# EAGLE design board (EAGLE 5.12)
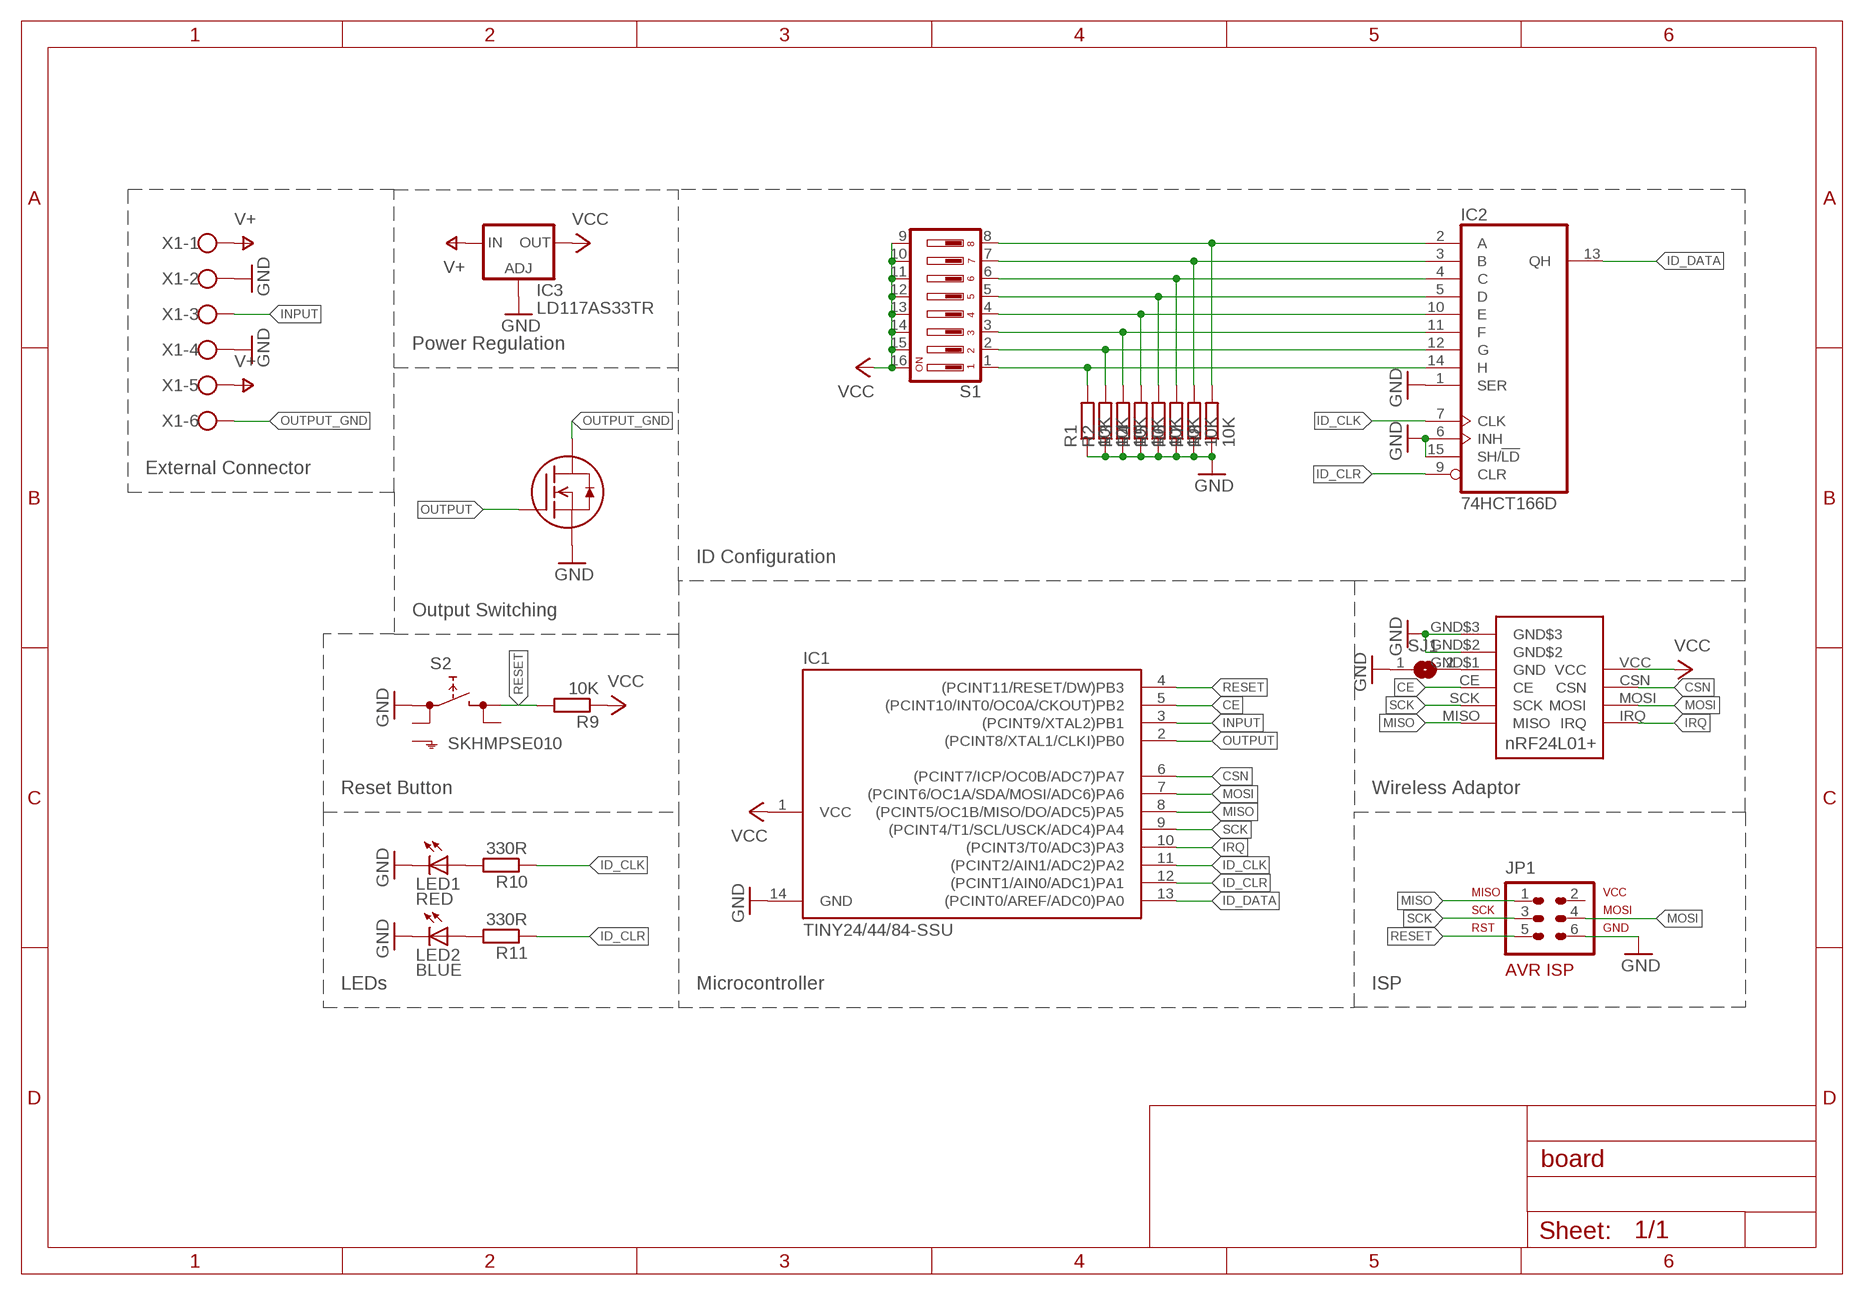
[diagram p0: schematic, sheet 1]

## Parts
CHINESE1  NRF24L01+CHINESE-DUAL  [CHINESE-DUALPINOUT]
IC1  TINY24/44/84-SSU  [SOIC14]
IC2  74HCT166D  [SO16]
IC3  LD117AS33TR  [SOT223]
JP1  AVR-ISP-6VERT  [AVR-ISP-6]
LED1  RED  LEDCHIPLED_1206  [CHIPLED_1206]
LED2  BLUE  LEDCHIPLED_1206  [CHIPLED_1206]
R1  10K  R-EU_R0805  [R0805]
R2  10K  R-EU_R0805  [R0805]
R3  10K  R-EU_R0805  [R0805]
R4  10K  R-EU_R0805  [R0805]
R5  10K  R-EU_R0805  [R0805]
R6  10K  R-EU_R0805  [R0805]
R7  10K  R-EU_R0805  [R0805]
R8  10K  R-EU_R0805  [R0805]
R9  10K  R-EU_R0805  [R0805]
R10  330R  R-EU_R0805  [R0805]
R11  330R  R-EU_R0805  [R0805]
S1  DS08  [DS-08]
S2  SKHMPSE010  [SKHMPXE010]
SJ1  SJ  [SJ]
U$1  NTF3055L108T1GTAB  [SOT223]
X1  W237-6  [W237-6]

## Nets
CE: CHINESE1.CE IC1.5((PCINT10/INT0/OC0A/CKOUT)PB2)
CSN: CHINESE1.CSN IC1.6((PCINT7/ICP/OC0B/ADC7)PA7)
GND: CHINESE1.GND$2 CHINESE1.GND$3 IC1.14(GND) IC2.1(SER) IC2.6(INH) IC2.15(SH/!LD) IC3.1(ADJ) JP1.6 LED1.C LED2.C R1.1 R2.1 R3.1 R4.1 R5.1 R6.1 R7.1 R8.1 S2.1(1.1) SJ1.1 U$1.3(S) X1.2 X1.4
ID_CLK: IC1.11((PCINT2/AIN1/ADC2)PA2) IC2.7(CLK) R10.1
ID_CLR: IC1.12((PCINT1/AIN0/ADC1)PA1) IC2.9(CLR) R11.1
ID_DATA: IC1.13((PCINT0/AREF/ADC0)PA0) IC2.13(QH)
INPUT: IC1.3((PCINT9/XTAL2)PB1) X1.3
IRQ: CHINESE1.IRQ IC1.10((PCINT3/T0/ADC3)PA3)
MISO: CHINESE1.MISO IC1.8((PCINT5/OC1B/MISO/DO/ADC5)PA5) JP1.1
MOSI: CHINESE1.MOSI IC1.7((PCINT6/OC1A/SDA/MOSI/ADC6)PA6) JP1.4
N$1: IC2.14(H) R1.2 S1.1
N$2: IC2.12(G) R2.2 S1.2
N$3: IC2.11(F) R3.2 S1.3
N$4: IC2.10(E) R4.2 S1.4
N$5: IC2.5(D) R5.2 S1.5
N$6: IC2.4(C) R6.2 S1.6
N$7: IC2.3(B) R7.2 S1.7
N$8: IC2.2(A) R8.2 S1.8
N$9: LED1.A R10.2
N$10: LED2.A R11.2
N$11: CHINESE1.GND$1(GND) SJ1.2
OUTPUT: IC1.2((PCINT8/XTAL1/CLKI)PB0) U$1.1(G)
OUTPUT_GND: U$1.4(D) X1.6
RESET: IC1.4((PCINT11/RESET/DW)PB3) JP1.5 R9.2 S2.3(2.1)
SCK: CHINESE1.SCK IC1.9((PCINT4/T1/SCL/USCK/ADC4)PA4) JP1.3
V+: IC3.3(IN) X1.1 X1.5
VCC: CHINESE1.VCC IC1.1(VCC) IC3.4(OUT) R9.1 S1.9 S1.10 S1.11 S1.12 S1.13 S1.14 S1.15 S1.16
Unconnected: JP1.2 S2.2(1.2) S2.4(2.2) S2.5(SH)

## Notes on the sheet
- Power Regulation
- External Connector
- ID Configuration
- Output Switching
- Reset Button | Wireless Adaptor
- LEDs | Microcontroller | ISP

## Power pins joined to a net without a drawn wire
GND: IC2.8(GND)
VCC: IC2.16(VCC)

## Library data of the parts
CHINESE1 = nrf24l01+:NRF24L01+
IC1 = avr-6:TINY24/44/84
IC2 = 74xx-eu:74*166: 8-bit parallel load SHIFT REGISTER
IC3 = v-reg:LD117A?*: Low drop fixed and adjustable positive voltage regulators 1 A Source: http://www.st.com/stonline/products/literature/ds/7194/ld1117axx.pdf
JP1 = avr-7:AVR-ISP-6: AVR ISP-6 Serial Programming Header
LED1 LED2 = led:LED: LED OSRAM: - CHIPLED LG R971, LG N971, LY N971, LG Q971, LY Q971, LO R971, LY R971 LH N974, LH R974 LS Q976, LO Q976, LY Q976 LO Q996 - Hyper CHIPLED LW Q18S LB Q993, LB Q99A, LB R99A - SideLED LS A670, LO A670, LY A670, LG A670, LP A670 LB A673, LV A673, LT A673, LW A673 LH A674 LY A675 LS A676, LA A676, LO A676, LY A676, LW A676 LS A679, LY A679, LG A679 - Hyper Micro SIDELED® LS Y876, LA Y876, LO Y876, LY Y876 LT Y87S - SmartLED LW L88C, LW L88S LB L89C, LB L89S, LG L890 LS L89K, LO L89K, LY L89K LS L896, LA L896, LO L896, LY L896 - TOPLED LS T670, LO T670, LY T670, LG T670, LP T670 LSG T670, LSP T670, LSY T670, LOP T670, LYG T670 LG T671, LOG T671, LSG T671 LB T673, LV T673, LT T673, LW T673 LH T674 LS T676, LA T676, LO T676, LY T676, LB T676, LH T676, LSB T676, LW T676 LB T67C, LV T67C, LT T67C, LS T67K, LO T67K, LY T67K, LW E67C LS E67B, LA E67B, LO E67B, LY E67B, LB E67C, LV E67C, LT E67C LW T67C LS T679, LY T679, LG T679 LS T770, LO T770, LY T770, LG T770, LP T770 LB T773, LV T773, LT T773, LW T773 LH T774 LS E675, LA E675, LY E675, LS T675 LS T776, LA T776, LO T776, LY T776, LB T776 LHGB T686 LT T68C, LB T68C - Hyper Mini TOPLED® LB M676 - Mini TOPLED Santana® LG M470 LS M47K, LO M47K, LY M47K Source: http://www.osram.convergy.de LUXEON: - LUMILED® LXK2-PW12-R00, LXK2-PW12-S00, LXK2-PW14-U00, LXK2-PW14-V00 LXK2-PM12-R00, LXK2-PM12-S00, LXK2-PM14-U00 LXK2-PE12-Q00, LXK2-PE12-R00, LXK2-PE12-S00, LXK2-PE14-T00, LXK2-PE14-U00 LXK2-PB12-K00, LXK2-PB12-L00, LXK2-PB12-M00, LXK2-PB14-N00, LXK2-PB14-P00, LXK2-PB14-Q00 LXK2-PR12-L00, LXK2-PR12-M00, LXK2-PR14-Q00, LXK2-PR14-R00 LXK2-PD12-Q00, LXK2-PD12-R00, LXK2-PD12-S00 LXK2-PH12-R00, LXK2-PH12-S00 LXK2-PL12-P00, LXK2-PL12-Q00, LXK2-PL12-R00 Source: www.luxeon.com KINGBRIGHT: KA-3528ASYC Source: www.kingbright.com
R1-R11 = rcl:R-EU_: RESISTOR, European symbol
S1 = switch-dil:DS08: DIL/CODE SWITCH; MPN: DS08; OC_FARNELL: unknown; OC_NEWARK: 73J0071
S2 = switch:SKHMP*E010: 6.2 X 6.5mm TACT Switch (SMD) Source: http://www3.alps.co.jp/WebObjects/catalog.woa/PDF/E/Switch/Tact/SKHM/SKHM.PDF
SJ1 = jumper:SJ: SMD solder JUMPER
U$1 = NTF3055L108:NTF3055L108T1G: Power MOSFET 3.0 A, 60 V, Logic Level, N?Channel SOT?223 Designed for low voltage, high speed switching applications in power supplies, converters and power motor controls and bridge circuits
X1 = con-wago-500:W237-6: WAGO SCREW CLAMP; OC_FARNELL: unknown; OC_NEWARK: unknown

## Board
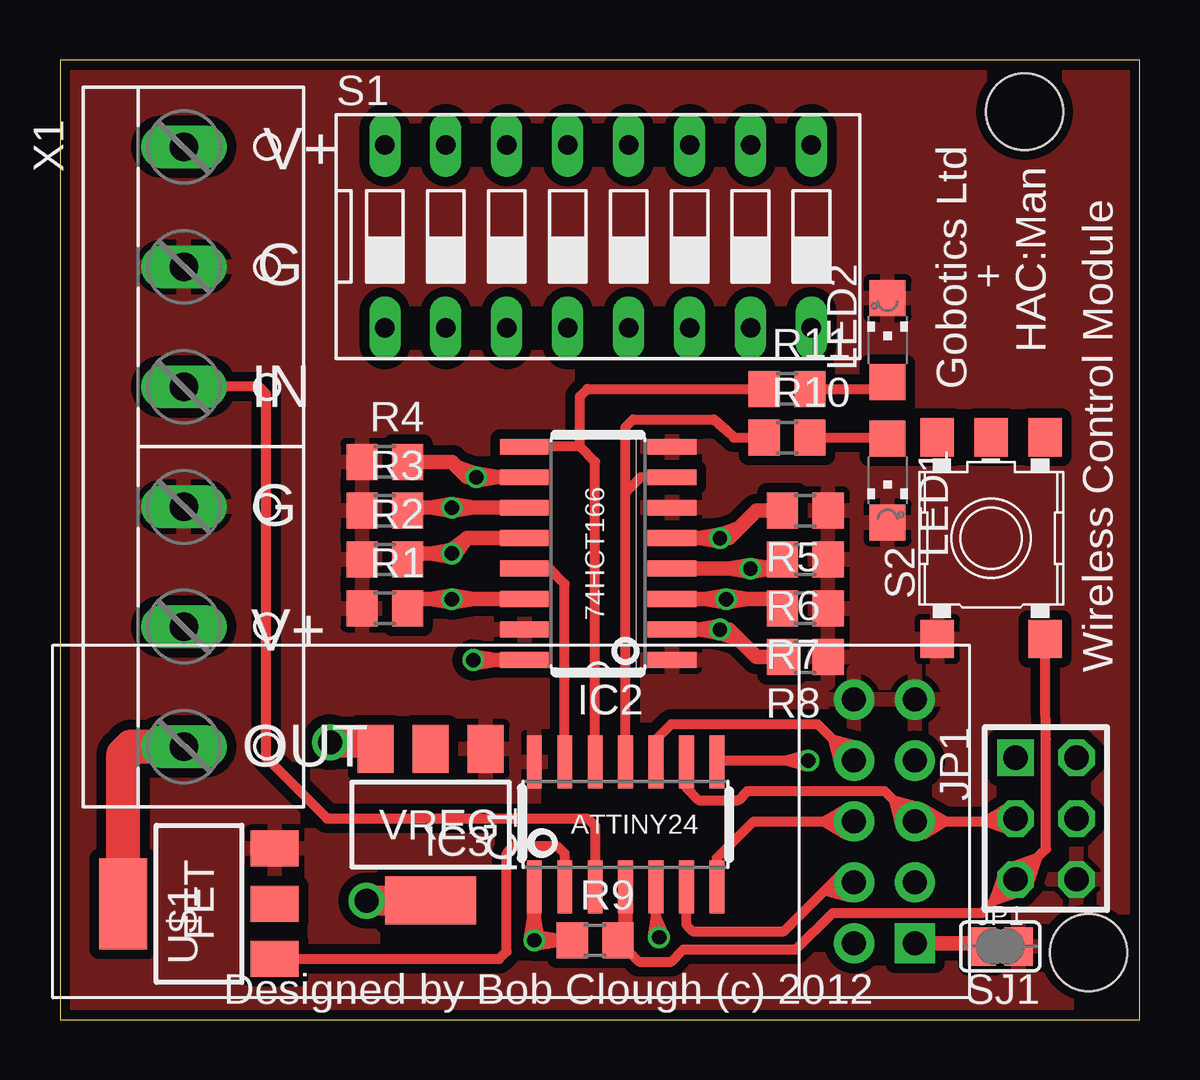
[diagram p1: board, top side]
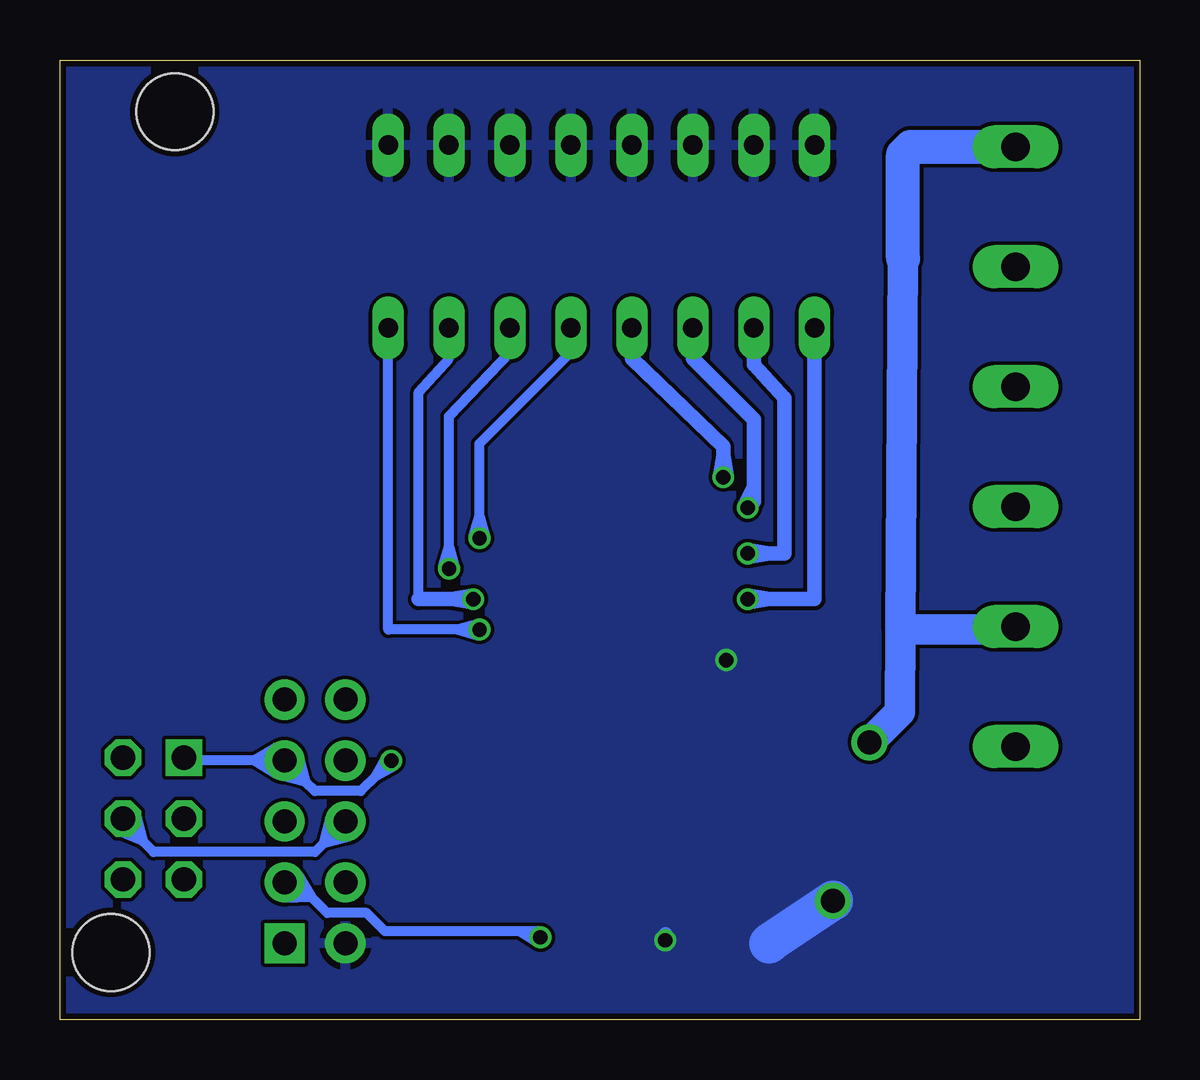
[diagram p2: board, bottom side, seen from below]

Size 45 x 40 mm. Coordinates in mm from the lower left corner, seen from the top.
Outline: 0,0 45,0 45,40 0,40 0,0
Copper layers (1*16): Top 0.035mm / dielectric 1.5mm / Bottom 0.035mm
Design rules "Seeed Fusion Design Rules": minimum track width 6mil, minimum drill 12mil, track to track 6mil, track to pad 6mil, pad to pad 6mil, via to via 6mil, smd to smd 0mil, copper to edge 10mil, drill to drill 10mil, minimum pad ring 10mil, minimum via ring 6mil, stop-mask expansion 2mil, vias tented up to drill 100mil, thermal gap 10mil
Holes 3.2 mm at 40.21,37.85 42.88,2.79

### Footprints (pad centres in the part's own frame; a part is rotated, then mirrored left to right if it is on the bottom)
CHINESE-DUALPINOUT = drill 1 pad 1.676 round: CE -10.16,0; CSN -7.62,0; GND$2 -10.16,-7.62; GND$3 -7.62,-7.62; IRQ -7.62,-5.08; MISO -10.16,-5.08; MOSI -7.62,-2.54; SCK -10.16,-2.54; VCC -7.62,2.54 | drill 1 pad 1.676 square: GND$1 -10.16,2.54
SOIC14 = smd 0.61 x 2.21: 1 -3.81,-2.603; 2 -2.54,-2.603; 3 -1.27,-2.603; 4 0,-2.603; 5 1.27,-2.603; 6 2.54,-2.603; 7 3.81,-2.603; 8 3.81,2.603; 9 2.54,2.603; 10 1.27,2.603; 11 0,2.603; 12 -1.27,2.603; 13 -2.54,2.603; 14 -3.81,2.603
SO16 = smd 0.66 x 2.032: 1 -4.445,-3.073; 2 -3.175,-3.073; 3 -1.905,-3.073; 4 -0.635,-3.073; 5 0.635,-3.073; 6 1.905,-3.073; 7 3.175,-3.073; 8 4.445,-3.073; 9 4.445,3.073; 10 3.175,3.073; 11 1.905,3.073; 12 0.635,3.073; 13 -0.635,3.073; 14 -1.905,3.073; 15 -3.175,3.073; 16 -4.445,3.073
SOT223 = smd 1.5 x 2: 1 -2.3,-3.15; 2 0,-3.15; 3 2.3,-3.15 | smd 3.8 x 2: 4 0,3.15
AVR-ISP-6 = drill 1.016 square: 1 -2.54,-1.27 | drill 1.016 octagon: 2 -2.54,1.27; 3 0,-1.27; 4 0,1.27; 5 2.54,-1.27; 6 2.54,1.27
CHIPLED_1206 = smd 1.5 x 1.5: A 0,-1.75; C 0,1.75
R0805 = smd 1.3 x 1.5: 1 -0.95,0; 2 0.95,0
DS-08 = drill 0.813 long: 1 -8.89,-3.81; 2 -6.35,-3.81; 3 -3.81,-3.81; 4 -1.27,-3.81; 5 1.27,-3.81; 6 3.81,-3.81; 7 6.35,-3.81; 8 8.89,-3.81; 9 8.89,3.81; 10 6.35,3.81; 11 3.81,3.81; 12 1.27,3.81; 13 -1.27,3.81; 14 -3.81,3.81; 15 -6.35,3.81; 16 -8.89,3.81
SKHMPXE010 = smd 1.6 x 1.4: 1 -4.2,2.25; 2 4.2,2.25; 3 -4.2,-2.25; 4 4.2,-2.25; 5 4.2,0
SJ = smd 1.168 x 1.6: 1 -0.762,0; 2 0.762,0
W237-6 = drill 1.194 long: 1 -12.5,-1.27; 2 -7.5,-1.27; 3 -2.5,-1.27; 4 2.5,-1.27; 5 7.5,-1.27; 6 12.5,-1.27

### Placement (x,y rotation side)
CHINESE1  25.48,5.71 180 top
IC1  23.57,8.13 0 top
IC2  22.43,19.43 90 top
IC3  15.45,8.13 180 top
JP1  41.1,8.38 270 top
LED1  34.5,22.48 180 top
LED2  34.5,28.32 0 top
R1  13.54,17.14 0 top
R2  13.54,19.18 0 top
R3  13.54,21.21 0 top
R4  13.54,23.24 0 top
R5  31.07,21.21 180 top
R6  31.07,19.18 180 top
R7  31.07,17.14 180 top
R8  31.07,15.11 180 top
R9  22.3,3.3 0 top
R10  30.31,24.26 0 top
R11  30.31,26.29 0 top
S1  22.43,32.64 0 top
S2  38.81,20.07 90 top
SJ1  39.2,3.05 180 top
U$1  5.79,4.83 90 top
X1  6.43,23.88 270 top

### Tracks (layer width: path | path; a pad name or v marks a point on that pad's centre or on a via)
CE  (via drill 0.6)
  Top 0.406: v24.97,3.43 24.84,3.43 24.84,4.32 | 24.84,4.32 IC1.5 | 24.84,4.32 24.73,3.46 v24.97,3.43 | 24.84,4.32 25.2,3.53 v24.97,3.43
  Bottom 0.406: 34.54,5.12 35.26,5.84 35.39,5.71 CHINESE1.CE | 25.84,3.68 25.23,3.68 v24.97,3.43 | 25.84,3.68 31.45,3.68 32.21,4.45 33.86,4.45 34.54,5.12 | 25.84,3.68 24.97,3.68 v24.97,3.43 | 25.84,3.68 25.11,3.22 v24.97,3.43 | 34.54,5.12 35.62,5.08 | 34.54,5.12 35.1,6.04 | 34.54,5.12 35.1,6.04 | 35.1,6.04 34.54,5.12 | 35.1,6.04 | 35.62,5.08 34.54,5.12 | 35.62,5.08 | CHINESE1.CE 35.62,5.08 | 34.54,5.12 35.1,6.04 | CHINESE1.CE 35.1,6.04 | 35.62,5.08 34.54,5.12 | 35.62,5.08 | CHINESE1.CE 35.62,5.08 | 35.1,6.04 34.54,5.12 | 35.1,6.04 CHINESE1.CE | 35.62,5.08 34.54,5.12 | 35.62,5.08 CHINESE1.CE | 34.54,5.12 35.1,6.04 | 35.1,6.04 CHINESE1.CE
CSN
  Top 0.406: IC1.6 26.11,3.94 26.37,3.68 30.18,3.68 31.89,5.4 | 31.89,5.4 32.21,5.71 CHINESE1.CSN | 31.89,5.4 32.93,5.1 CHINESE1.CSN | 31.89,5.4 32.65,6.16 CHINESE1.CSN
GND
  pour Top (isolate 0.406): -7.29,51.82 47.32,51.82 47.32,-3.3 -7.29,-3.3
ID_CLK
  Top 0.406: IC2.7 24.21,22.61 23.57,21.97 | IC1.11 23.57,21.97 | R10.1 28.08,24.26 27.77,24.57 27.26,25.02 23.89,25.02 23.57,24.7 23.57,21.97
ID_CLR
  Top 0.406: 21.67,23.88 IC2.9 | 21.67,23.88 22.3,23.24 IC1.12 | R11.1 21.99,26.29 21.67,25.97 21.67,23.88
ID_DATA
  Top 0.406: IC2.13 20.4,18.8 21.04,18.16 IC1.13
INPUT
  Top 0.406: IC1.3 22.3,8.06 21.99,8.38 11.13,8.38 8.59,10.92 8.59,26.08 8.3,26.38 X1.3
IRQ
  Top 0.406: IC1.10 24.84,11.68 25.48,12.32 31.58,12.32 32.22,11.68 | 32.22,11.68 CHINESE1.IRQ | 32.22,11.68 32.48,10.64 CHINESE1.IRQ | 32.22,11.68 33.26,11.41 CHINESE1.IRQ
MISO  (via drill 0.6)
  Top 0.406: IC1.8 27.45,10.79 30.3,10.79 | 30.3,10.79 v31.2,10.79 | 30.3,10.79 | 30.3,10.79 31.13,10.56 | 30.3,10.79 31.13,11.03 | 31.13,11.03 | v31.2,10.79 31.13,11.03 | 31.13,10.56 30.3,10.79 | 31.13,10.56 | 30.3,10.79 | 30.3,10.79 31.13,10.56 | 31.13,10.56 | v31.2,10.79 31.13,10.56 | 31.13,11.03 30.3,10.79 | 30.3,10.79 31.13,10.56 | 31.13,10.56 v31.2,10.79 | 30.3,10.79 31.13,11.03 | 31.13,11.03 | 31.13,11.03 v31.2,10.79 | 30.3,10.79 31.13,10.56 | v31.2,10.79 31.13,10.56 | 31.13,11.03 30.3,10.79 | 31.13,11.03 v31.2,10.79
  Bottom 0.406: v31.2,10.79 31.83,10.16 | 31.83,10.16 32.47,9.53 34.37,9.53 34.76,9.91 | 34.76,9.91 CHINESE1.MISO | JP1.1 39.7,10.79 36.89,10.79 | CHINESE1.MISO 36.89,10.79 | 36.89,10.79 | 31.83,10.16 31.41,10.91 v31.2,10.79 | 31.83,10.16 31.07,10.58 v31.2,10.79 | 35.96,10.25 36.89,10.79 | 36.89,10.79 35.96,11.34 CHINESE1.MISO | 36.89,10.79 35.96,10.25 | 34.76,9.91 35.8,10.18 CHINESE1.MISO | 34.76,9.91 35.02,10.95 CHINESE1.MISO | 35.96,11.34 36.89,10.79 | CHINESE1.MISO 35.96,11.34 | 35.96,10.25 36.89,10.79 | CHINESE1.MISO 35.96,10.25 | 35.96,11.34 36.89,10.79 | 36.89,10.79 | 35.96,10.25 36.89,10.79 | CHINESE1.MISO 35.96,10.25 | 35.96,11.34 36.89,10.79 | CHINESE1.MISO 35.96,11.34 | 36.89,10.79 35.96,10.25 CHINESE1.MISO
MOSI
  Top 0.406: IC1.7 27.38,6.73 28.91,8.26 31.85,8.26 | 31.85,8.26 | 31.85,8.26 CHINESE1.MOSI | 31.85,8.26 | 31.85,8.26 32.78,7.71 | 31.85,8.26 32.78,7.71 | 31.85,8.26 32.78,8.8 | CHINESE1.MOSI 32.78,8.8 | 31.85,8.26 32.78,7.71 | CHINESE1.MOSI 32.78,7.71 | 31.85,8.26 32.78,8.8 | 31.85,8.26 32.78,7.71 | 32.78,7.71 CHINESE1.MOSI | 31.85,8.26 32.78,8.8 | 32.78,8.8 CHINESE1.MOSI | 32.78,7.71 31.85,8.26 | CHINESE1.MOSI 32.78,7.71 | 31.85,8.26 32.78,8.8 | CHINESE1.MOSI 32.78,8.8
  Bottom 0.406: CHINESE1.MOSI 33.98,7.37 | 33.98,7.37 34.37,6.99 41.1,6.99 41.54,7.42 | 41.54,7.42 42.37,8.26 JP1.4 | 41.54,7.42 42.59,7.87 JP1.4 | 41.54,7.42 41.83,8.53 JP1.4 | 33.98,7.37 33.72,8.41 CHINESE1.MOSI | 33.98,7.37 32.94,7.64 CHINESE1.MOSI
N$1  (via drill 0.6)
  Top 0.61: R1.2 14.87,17.53 15.44,17.53 | 15.44,17.53 v16.34,17.53 | v16.34,17.53 17.24,17.53 | 15.44,17.53 | 17.24,17.53 | 17.24,17.53 IC2.14 | 15.44,17.53 16.31,17.38 | 16.31,17.38 | v16.34,17.53 16.31,17.38 | 15.44,17.53 16.31,17.67 | 16.31,17.67 | 16.31,17.67 | 17.24,17.53 16.36,17.67 | 17.24,17.53 16.36,17.38 | 16.36,17.67 | 16.36,17.67 | 16.36,17.38 | v16.34,17.53 16.36,17.38 | 15.44,17.53 | 16.31,17.67 15.44,17.53 | 16.31,17.38 15.44,17.53 | 16.31,17.38 | v16.34,17.53 16.31,17.38 | 15.44,17.53 16.31,17.67 | v16.34,17.53 16.31,17.67 | 15.44,17.53 16.31,17.38 | 15.44,17.53 16.31,17.67 | 16.31,17.38 15.44,17.53 | 16.31,17.38 v16.34,17.53 | 16.31,17.67 15.44,17.53 | 16.31,17.67 v16.34,17.53 | 16.36,17.67 17.24,17.53 | 17.24,17.53 | 16.36,17.38 17.24,17.53 | 16.36,17.67 17.24,17.53 | v16.34,17.53 16.36,17.67 | 16.36,17.38 17.24,17.53 | v16.34,17.53 16.36,17.38 | 16.36,17.67 17.24,17.53 | v16.34,17.53 16.36,17.67 | 16.36,17.38 17.24,17.53 | v16.34,17.53 16.36,17.38
  Bottom 0.61: S1.1 13.54,17.53 15.44,17.53 | v16.34,17.53 15.44,17.53 | 15.44,17.53 | 15.44,17.53 16.31,17.38 | 16.31,17.38 | v16.34,17.53 16.31,17.38 | 15.44,17.53 16.31,17.67 | 16.31,17.67 | 16.31,17.67 | 15.44,17.53 | 16.31,17.67 15.44,17.53 | 16.31,17.38 15.44,17.53 | 16.31,17.38 | v16.34,17.53 16.31,17.38 | 16.31,17.67 15.44,17.53 | v16.34,17.53 16.31,17.67 | 16.31,17.38 15.44,17.53 | 16.31,17.67 15.44,17.53 | 16.31,17.38 15.44,17.53 | v16.34,17.53 16.31,17.38 | 16.31,17.67 15.44,17.53 | v16.34,17.53 16.31,17.67
N$2  (via drill 0.6)
  Top 0.61: R2.2 14.75,19.43 15.44,19.43 | 15.44,19.43 v16.34,19.43 | v16.34,19.43 16.97,20.07 | 16.97,20.07 IC2.12 | 15.44,19.43 | 15.44,19.43 16.31,19.29 | 16.31,19.29 | v16.34,19.43 16.31,19.29 | 15.44,19.43 16.31,19.58 | 16.31,19.58 | 16.31,19.58 | 15.44,19.43 | 16.31,19.58 15.44,19.43 | 16.31,19.29 15.44,19.43 | 16.31,19.29 | v16.34,19.43 16.31,19.29 | 15.44,19.43 16.31,19.58 | v16.34,19.43 16.31,19.58 | 15.44,19.43 16.31,19.29 | 15.44,19.43 16.31,19.58 | 16.31,19.29 15.44,19.43 | 16.31,19.29 v16.34,19.43 | 16.31,19.58 15.44,19.43 | 16.31,19.58 v16.34,19.43 | 16.97,20.07 16.25,19.55 v16.34,19.43 | 16.97,20.07 16.46,19.34 v16.34,19.43
  Bottom 0.61: S1.2 16.08,27.3 14.81,25.91 14.81,19.43 15.44,19.43 | v16.34,19.43 15.44,19.43 | 15.44,19.43 | 15.44,19.43 16.31,19.29 | 16.31,19.29 | v16.34,19.43 16.31,19.29 | 15.44,19.43 16.31,19.58 | 16.31,19.58 | 16.31,19.58 | 15.44,19.43 | 16.31,19.58 15.44,19.43 | 16.31,19.29 15.44,19.43 | 16.31,19.29 | v16.34,19.43 16.31,19.29 | 16.31,19.58 15.44,19.43 | v16.34,19.43 16.31,19.58 | 16.31,19.29 15.44,19.43 | 16.31,19.58 15.44,19.43 | 16.31,19.29 15.44,19.43 | v16.34,19.43 16.31,19.29 | 16.31,19.58 15.44,19.43 | v16.34,19.43 16.31,19.58
N$3  (via drill 0.6)
  Top 0.61: R3.2 14.62,21.34 15.44,21.34 | 15.44,21.34 v16.34,21.34 | v16.34,21.34 17.24,21.34 | 15.44,21.34 | 17.24,21.34 | 17.24,21.34 IC2.11 | 15.44,21.34 16.31,21.19 | 16.31,21.19 | v16.34,21.34 16.31,21.19 | 15.44,21.34 16.31,21.48 | 16.31,21.48 | 16.31,21.48 | 17.24,21.34 16.36,21.48 | 17.24,21.34 16.36,21.19 | 16.36,21.48 | 16.36,21.48 | 16.36,21.19 | v16.34,21.34 16.36,21.19 | 15.44,21.34 | 16.31,21.48 15.44,21.34 | 16.31,21.19 15.44,21.34 | 16.31,21.19 | v16.34,21.34 16.31,21.19 | 15.44,21.34 16.31,21.48 | v16.34,21.34 16.31,21.48 | 15.44,21.34 16.31,21.19 | 15.44,21.34 16.31,21.48 | 16.31,21.19 15.44,21.34 | 16.31,21.19 v16.34,21.34 | 16.31,21.48 15.44,21.34 | 16.31,21.48 v16.34,21.34 | 16.36,21.48 17.24,21.34 | 17.24,21.34 | 16.36,21.19 17.24,21.34 | 16.36,21.48 17.24,21.34 | v16.34,21.34 16.36,21.48 | 16.36,21.19 17.24,21.34 | v16.34,21.34 16.36,21.19 | 16.36,21.48 17.24,21.34 | v16.34,21.34 16.36,21.48 | 16.36,21.19 17.24,21.34 | v16.34,21.34 16.36,21.19
  Bottom 0.61: S1.3 18.62,27.56 16.08,25.02 16.08,22.2 | 16.08,22.2 16.08,21.59 v16.34,21.34 | 16.08,22.2 16.19,21.32 v16.34,21.34 | 16.08,22.2 16.47,21.4 v16.34,21.34
N$4  (via drill 0.6)
  Top 0.61: R4.2 16.34,23.24 16.55,23.02 | 16.55,23.02 16.97,22.61 v17.35,22.61 | v17.35,22.61 18.25,22.61 | 18.25,22.61 | 18.25,22.61 IC2.10 | 16.55,23.02 | 16.55,23.02 17.26,22.49 | v17.35,22.61 17.26,22.49 | 16.55,23.02 17.4,22.75 | 17.4,22.75 v17.35,22.61 | 18.25,22.61 17.38,22.75 | 18.25,22.61 17.38,22.46 | 17.38,22.75 | 17.38,22.75 | 17.38,22.46 | v17.35,22.61 17.38,22.46 | 16.55,23.02 17.26,22.49 | v17.35,22.61 17.26,22.49 | 16.55,23.02 17.4,22.75 | v17.35,22.61 17.4,22.75 | 17.38,22.75 18.25,22.61 | 18.25,22.61 | 17.38,22.46 18.25,22.61 | 17.38,22.75 18.25,22.61 | v17.35,22.61 17.38,22.75 | 17.38,22.46 18.25,22.61 | v17.35,22.61 17.38,22.46 | 17.38,22.75 18.25,22.61 | v17.35,22.61 17.38,22.75 | 17.38,22.46 18.25,22.61 | v17.35,22.61 17.38,22.46
  Bottom 0.61: S1.4 21.16,27.56 17.35,23.88 17.35,23.51 | v17.35,22.61 17.35,23.51 | 17.35,23.51 | 17.35,23.51 17.21,22.63 | 17.21,22.63 | v17.35,22.61 17.21,22.63 | 17.35,23.51 17.5,22.63 | 17.5,22.63 | 17.5,22.63 | 17.35,23.51 | 17.5,22.63 17.35,23.51 | 17.21,22.63 17.35,23.51 | 17.21,22.63 | v17.35,22.61 17.21,22.63 | 17.5,22.63 17.35,23.51 | v17.35,22.61 17.5,22.63 | 17.21,22.63 17.35,23.51 | 17.5,22.63 17.35,23.51 | 17.21,22.63 17.35,23.51 | v17.35,22.61 17.21,22.63 | 17.5,22.63 17.35,23.51 | v17.35,22.61 17.5,22.63
N$5  (via drill 0.6)
  Top 0.61: v27.51,20.07 27.89,20.07 28.31,20.48 | 28.31,20.48 29.04,21.21 R5.2 | 26.61,20.07 v27.51,20.07 | IC2.5 26.61,20.07 | 26.61,20.07 | 28.31,20.48 | 26.61,20.07 27.49,19.92 | 27.49,19.92 | v27.51,20.07 27.49,19.92 | 26.61,20.07 27.49,20.21 | 27.49,20.21 | 27.49,20.21 | 26.61,20.07 | 27.49,20.21 26.61,20.07 | 27.47,20.21 28.31,20.48 | v27.51,20.07 27.47,20.21 | 27.6,19.95 28.31,20.48 | 27.6,19.95 | v27.51,20.07 27.6,19.95 | 27.47,20.21 28.31,20.48 | v27.51,20.07 27.47,20.21 | 27.6,19.95 28.31,20.48 | v27.51,20.07 27.6,19.95 | 27.49,19.92 26.61,20.07 | 27.49,19.92 | v27.51,20.07 27.49,19.92 | 26.61,20.07 27.49,20.21 | v27.51,20.07 27.49,20.21 | 26.61,20.07 27.49,19.92 | 26.61,20.07 27.49,20.21 | 27.49,19.92 26.61,20.07 | 27.49,19.92 v27.51,20.07 | 27.49,20.21 26.61,20.07 | 27.49,20.21 v27.51,20.07
  Bottom 0.406: S1.5 23.7,27.81 27.51,24 27.51,20.97 | v27.51,20.07 27.51,20.97 | 27.51,20.97 | 27.51,20.97 27.27,20.14 | 27.51,20.97 27.75,20.14 | 27.75,20.14 | v27.51,20.07 27.75,20.14 | 27.27,20.14 27.51,20.97 | 27.27,20.14 | 27.51,20.97 | 27.27,20.14 27.51,20.97 | 27.27,20.14 | v27.51,20.07 27.27,20.14 | 27.75,20.14 27.51,20.97 | 27.27,20.14 27.51,20.97 | v27.51,20.07 27.27,20.14 | 27.75,20.14 27.51,20.97 | 27.75,20.14 | v27.51,20.07 27.75,20.14 | 27.27,20.14 27.51,20.97 | v27.51,20.07 27.27,20.14 | 27.75,20.14 27.51,20.97 | v27.51,20.07 27.75,20.14
N$6  (via drill 0.6)
  Top 0.61: v28.78,18.8 29.68,18.8 | R6.2 29.74,18.8 29.68,18.8 | 27.88,18.8 v28.78,18.8 | 29.68,18.8 | IC2.4 27.88,18.8 | 27.88,18.8 | 29.68,18.8 28.81,18.94 | 29.68,18.8 28.81,18.65 | 28.81,18.94 | 28.81,18.94 | 28.81,18.65 | v28.78,18.8 28.81,18.65 | 27.88,18.8 28.76,18.65 | 28.76,18.65 | v28.78,18.8 28.76,18.65 | 27.88,18.8 28.76,18.94 | 28.76,18.94 | 28.76,18.94 | 27.88,18.8 | 28.76,18.94 27.88,18.8 | 28.81,18.94 29.68,18.8 | 29.68,18.8 | 28.81,18.65 29.68,18.8 | 28.81,18.94 29.68,18.8 | v28.78,18.8 28.81,18.94 | 28.81,18.65 29.68,18.8 | v28.78,18.8 28.81,18.65 | 28.81,18.94 29.68,18.8 | v28.78,18.8 28.81,18.94 | 28.81,18.65 29.68,18.8 | v28.78,18.8 28.81,18.65 | 28.76,18.65 27.88,18.8 | 28.76,18.65 | v28.78,18.8 28.76,18.65 | 27.88,18.8 28.76,18.94 | v28.78,18.8 28.76,18.94 | 27.88,18.8 28.76,18.65 | 27.88,18.8 28.76,18.94 | 28.76,18.65 27.88,18.8 | 28.76,18.65 v28.78,18.8 | 28.76,18.94 27.88,18.8 | 28.76,18.94 v28.78,18.8
  Bottom 0.406: S1.6 26.24,27.81 28.78,25.15 28.78,19.7 | v28.78,18.8 28.78,19.7 | 28.78,19.7 | 28.78,19.7 28.54,18.86 | 28.78,19.7 29.02,18.86 | 29.02,18.86 | v28.78,18.8 29.02,18.86 | 28.54,18.86 28.78,19.7 | 28.54,18.86 | 28.78,19.7 | 28.54,18.86 28.78,19.7 | 28.54,18.86 | v28.78,18.8 28.54,18.86 | 29.02,18.86 28.78,19.7 | 28.54,18.86 28.78,19.7 | v28.78,18.8 28.54,18.86 | 29.02,18.86 28.78,19.7 | 29.02,18.86 | v28.78,18.8 29.02,18.86 | 28.54,18.86 28.78,19.7 | v28.78,18.8 28.54,18.86 | 29.02,18.86 28.78,19.7 | v28.78,18.8 29.02,18.86
N$7  (via drill 0.6)
  Top 0.61: v27.77,17.53 28.67,17.53 | R7.2 29.74,17.53 28.67,17.53 | 26.87,17.53 v27.77,17.53 | 28.67,17.53 | IC2.3 26.87,17.53 | 26.87,17.53 | 28.67,17.53 27.79,17.67 | 28.67,17.53 27.79,17.38 | 27.79,17.67 | 27.79,17.67 | 27.79,17.38 | v27.77,17.53 27.79,17.38 | 26.87,17.53 27.74,17.38 | 27.74,17.38 | v27.77,17.53 27.74,17.38 | 26.87,17.53 27.74,17.67 | 27.74,17.67 | 27.74,17.67 | 26.87,17.53 | 27.74,17.67 26.87,17.53 | 27.79,17.67 28.67,17.53 | 28.67,17.53 | 27.79,17.38 28.67,17.53 | 27.79,17.67 28.67,17.53 | v27.77,17.53 27.79,17.67 | 27.79,17.38 28.67,17.53 | v27.77,17.53 27.79,17.38 | 27.79,17.67 28.67,17.53 | v27.77,17.53 27.79,17.67 | 27.79,17.38 28.67,17.53 | v27.77,17.53 27.79,17.38 | 27.74,17.38 26.87,17.53 | 27.74,17.38 | v27.77,17.53 27.74,17.38 | 26.87,17.53 27.74,17.67 | v27.77,17.53 27.74,17.67 | 26.87,17.53 27.74,17.38 | 26.87,17.53 27.74,17.67 | 27.74,17.38 26.87,17.53 | 27.74,17.38 v27.77,17.53 | 27.74,17.67 26.87,17.53 | 27.74,17.67 v27.77,17.53
  Bottom 0.406: S1.7 28.78,27.56 30.05,26.16 30.05,17.53
  Bottom 0.61: v27.77,17.53 28.67,17.53 | 28.67,17.53 | 28.67,17.53 30.05,17.53 | 28.67,17.53 27.79,17.67 | 28.67,17.53 27.79,17.38 | 27.79,17.67 | 27.79,17.67 | 27.79,17.38 | v27.77,17.53 27.79,17.38 | 27.79,17.67 28.67,17.53 | 28.67,17.53 | 27.79,17.38 28.67,17.53 | 27.79,17.67 28.67,17.53 | v27.77,17.53 27.79,17.67 | 27.79,17.38 28.67,17.53 | v27.77,17.53 27.79,17.38 | 27.79,17.67 28.67,17.53 | v27.77,17.53 27.79,17.67 | 27.79,17.38 28.67,17.53 | v27.77,17.53 27.79,17.38
N$8  (via drill 0.6)
  Top 0.61: v27.51,16.26 27.89,16.26 28.31,15.84 | 28.31,15.84 29.04,15.11 R8.2 | v27.51,16.26 26.61,16.26 | 26.61,16.26 | 26.61,16.26 IC2.2 | 27.6,16.37 28.31,15.84 | 27.6,16.37 | 27.6,16.37 v27.51,16.26 | 26.61,16.26 27.49,16.11 | 27.49,16.11 | v27.51,16.26 27.49,16.11 | 26.61,16.26 27.49,16.4 | 27.49,16.4 | 27.49,16.4 | 26.61,16.26 | 27.49,16.4 26.61,16.26 | 28.31,15.84 27.6,16.37 | 27.6,16.37 v27.51,16.26 | 28.31,15.84 | 28.31,15.84 27.47,16.12 | 27.47,16.12 v27.51,16.26 | 28.31,15.84 27.6,16.37 | 27.6,16.37 v27.51,16.26 | 28.31,15.84 27.47,16.12 | 27.47,16.12 v27.51,16.26 | 27.49,16.11 26.61,16.26 | 27.49,16.11 | v27.51,16.26 27.49,16.11 | 27.49,16.4 26.61,16.26 | v27.51,16.26 27.49,16.4 | 27.49,16.11 26.61,16.26 | 27.49,16.4 26.61,16.26 | 27.49,16.11 26.61,16.26 | v27.51,16.26 27.49,16.11 | 27.49,16.4 26.61,16.26 | v27.51,16.26 27.49,16.4
  Bottom 0.406: S1.8 31.32,16.26 28.41,16.26 | v27.51,16.26 28.41,16.26 | 28.41,16.26 | 28.41,16.26 27.58,16.5 | 27.58,16.5 | v27.51,16.26 27.58,16.5 | 28.41,16.26 27.58,16.02 | 27.58,16.02 | 27.58,16.5 28.41,16.26 | 27.58,16.5 | 27.58,16.5 28.41,16.26 | v27.51,16.26 27.58,16.5 | 28.41,16.26 | 27.58,16.02 28.41,16.26 | 27.58,16.02 | v27.51,16.26 27.58,16.02 | 27.58,16.5 28.41,16.26 | 27.58,16.02 28.41,16.26 | v27.51,16.26 27.58,16.02 | 27.58,16.5 28.41,16.26 | v27.51,16.26 27.58,16.5 | 27.58,16.02 28.41,16.26 | v27.51,16.26 27.58,16.02
N$9
  Top 0.406: R10.2 34.47,24.26 LED1.A
N$10
  Top 0.406: R11.2 34.22,26.29 LED2.A
N$11
  Top 0.61: CHINESE1.GND$1 38.31,3.17 SJ1.2
OUTPUT
  Top 0.406: IC1.2 21.04,6.92 20.72,7.24 18.94,7.24 18.62,6.92 18.62,2.84 18.3,2.53 U$1.1
OUTPUT_GND
  Top 1.422: U$1.4 2.64,11.06 2.96,11.38 X1.6
RESET
  Top 0.406: R9.2 24.14,2.41 25.48,2.41 25.99,2.92 30.69,2.92 32.21,4.45 38.43,4.45 38.93,4.94 | S2.3 41.06,13.55 41.1,11.68 41.1,7.11 40.73,6.74 | JP1.5 40.73,6.74 | 40.73,6.74 | JP1.5 40.22,5.44 | 38.93,4.94 JP1.5 | 39.65,6.37 40.73,6.74 | JP1.5 39.65,6.37 | 40.36,5.66 40.73,6.74 | JP1.5 40.36,5.66 | JP1.5 39.95,5.34 | JP1.5 39.95,6.34 | 38.93,4.94 | 38.93,4.94 40.01,5.31 | JP1.5 40.01,5.31 | 38.93,4.94 | 38.93,4.94 39.3,6.02 | JP1.5 39.3,6.02 | 40.73,6.74 39.65,6.37 | JP1.5 39.65,6.37 | 40.73,6.74 40.36,5.66 | JP1.5 40.36,5.66 | 38.93,4.94 40.01,5.31 | 38.93,4.94 39.3,6.02 | 38.93,4.94 40.01,5.31 | JP1.5 40.01,5.31 | 38.93,4.94 39.3,6.02 | JP1.5 39.3,6.02
  Top 0.61: IC1.4 23.57,3.62 R9.2
SCK
  Top 0.406: JP1.3 39.7,8.26 38.57,8.26 | CHINESE1.SCK 36.89,8.26 | 36.89,8.26 | 36.89,8.26 38.57,8.26 | IC1.9 26.11,9.65 26.62,9.14 28.27,9.14 28.66,9.53 34.37,9.53 34.76,9.14 | 34.76,9.14 CHINESE1.SCK | 38.57,8.26 39.64,7.86 JP1.3 | 38.57,8.26 39.54,8.86 JP1.3 | 35.96,7.71 36.89,8.26 | 36.89,8.26 35.96,8.8 CHINESE1.SCK | 36.89,8.26 35.96,7.71 | 35.96,8.8 36.89,8.26 | CHINESE1.SCK 35.96,8.8 | 35.96,7.71 36.89,8.26 | CHINESE1.SCK 35.96,7.71 | 35.96,8.8 36.89,8.26 | 36.89,8.26 | 35.96,7.71 36.89,8.26 | CHINESE1.SCK 35.96,7.71 | 35.96,8.8 36.89,8.26 | CHINESE1.SCK 35.96,8.8 | 36.89,8.26 35.96,7.71 CHINESE1.SCK | 34.76,9.14 35.02,8.1 CHINESE1.SCK | 34.76,9.14 35.8,8.87 CHINESE1.SCK
V+  (via drill 1)
  Top 1.27: v11.26,11.56 12.87,11.56 IC3.3
  Bottom 0.406: 5.21,16.26 5.21,16.33 X1.5
  Bottom 1.27: 9.96,16.26 9.99,12.83 v11.26,11.56 | 9.96,16.26 9.86,31.74 | 5.21,16.26 9.96,16.26
  Bottom 1.422: 9.86,31.74 9.86,36.06 9.54,36.38 X1.1
VCC  (via drill 0.6, 1)
  Top 0.61: v19.77,3.3 19.77,4.2 | v17.23,14.99 18.12,14.99 | v19.77,3.3 20.66,3.3 | 19.77,4.2 | 19.77,4.2 IC1.1 | 20.66,3.3 | 20.66,3.3 R9.1 | 19.77,4.2 19.62,3.33 | 19.62,3.33 | v19.77,3.3 19.62,3.33 | 19.77,4.2 19.91,3.33 | 19.91,3.33 | 19.91,3.33 | 20.66,3.3 19.79,3.45 | 20.66,3.3 19.79,3.16 | 19.79,3.45 | 19.79,3.45 | 19.79,3.16 | v19.77,3.3 19.79,3.16 | 18.12,14.99 | 18.12,14.99 IC2.16 | 18.12,14.99 17.25,15.13 | 18.12,14.99 17.25,14.84 | 17.25,15.13 | 17.25,15.13 | 17.25,14.84 | v17.23,14.99 17.25,14.84 | 19.77,4.2 | 19.91,3.33 19.77,4.2 | 19.62,3.33 19.77,4.2 | 19.62,3.33 | v19.77,3.3 19.62,3.33 | 19.91,3.33 19.77,4.2 | v19.77,3.3 19.91,3.33 | 19.62,3.33 19.77,4.2 | 19.91,3.33 19.77,4.2 | 19.62,3.33 19.77,4.2 | v19.77,3.3 19.62,3.33 | 19.91,3.33 19.77,4.2 | v19.77,3.3 19.91,3.33 | 19.79,3.45 20.66,3.3 | 20.66,3.3 | 19.79,3.16 20.66,3.3 | 19.79,3.45 20.66,3.3 | v19.77,3.3 19.79,3.45 | 19.79,3.16 20.66,3.3 | v19.77,3.3 19.79,3.16 | 19.79,3.45 20.66,3.3 | v19.77,3.3 19.79,3.45 | 19.79,3.16 20.66,3.3 | v19.77,3.3 19.79,3.16 | 17.25,15.13 18.12,14.99 | 18.12,14.99 | 17.25,14.84 18.12,14.99 | 17.25,15.13 18.12,14.99 | v17.23,14.99 17.25,15.13 | 17.25,14.84 18.12,14.99 | v17.23,14.99 17.25,14.84 | 17.25,15.13 18.12,14.99 | v17.23,14.99 17.25,15.13 | 17.25,14.84 18.12,14.99 | v17.23,14.99 17.25,14.84
  Top 1.27: v12.78,4.95 IC3.4
  Bottom 0.61: v19.77,3.3 19.77,3.56 | v17.23,14.99 17.35,14.99
  Bottom 1.676: v12.78,4.95 15.45,3.17
  pour Bottom: -6.27,51.31 46.56,51.31 46.56,-2.03 -6.27,-2.03

### Text on the board
_tsilk: V+ | G | + | HAC:Man | IN | Gobotics Ltd | G | 74HCT166 | V+ | Wireless Control Module | OUT | ATTINY24 | VREG | JP1 | FET | Designed by Bob Clough (c) 2012